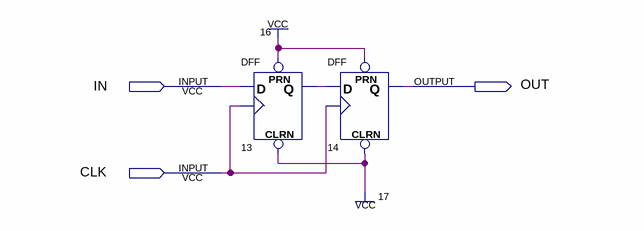
[diagram p0: schematic sheet]
// Quartus schematic sr2.bdf as structural Verilog: 2 symbols, 3 pins
module sr2 (
  input  IN,
  input  CLK,
  output OUT
);

  wire n13_q;

  DFF u_13 (.CLRN(1'b1), .CLK(CLK), .D(IN), .PRN(1'b1), .Q(n13_q));
  DFF u_14 (.CLRN(1'b1), .CLK(CLK), .D(n13_q), .PRN(1'b1), .Q(OUT));
endmodule
